# Altium schematic sheet Power_circuit.SchDoc
size A4; SheetNumber: 2; SheetTotal: 5
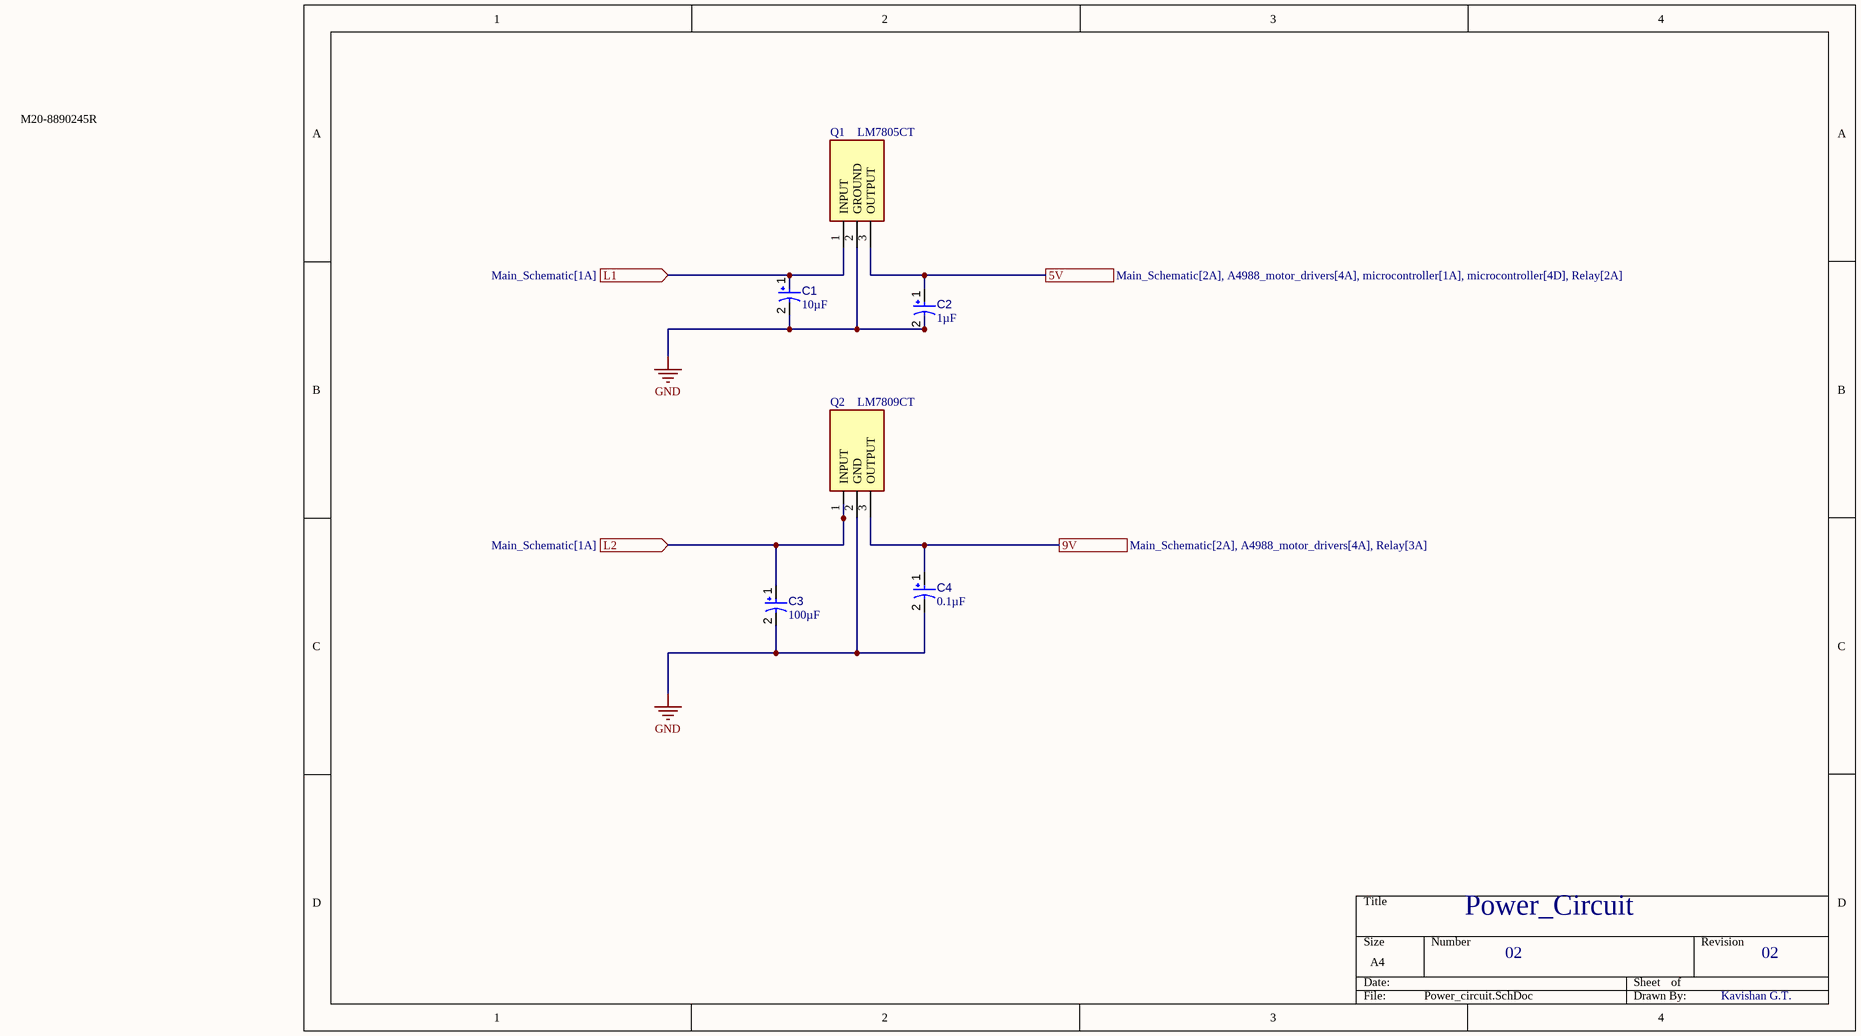
[diagram p0: Power_circuit.SchDoc]

## Parts
C1  value 10µF  [CAPPR55-200-1100X500X1200]  (hidden comment: ECA1HM100)
C2  value 1µF  [CAPPR55-200-1100X500X1200]  (hidden comment: ECA1HM100)
C3  value 100µF  [CAPPR55-200-1100X500X1200]  (hidden comment: ECA1HM100)
C4  value 0.1µF  [CAPPR55-200-1100X500X1200]  (hidden comment: ECA1HM100)
Q1  LM7805CT  [TO254P470X1028X1955-3P]
Q2  LM7809CT  [TO254P470X1016X2019-3P]

## Ports
5V (see Main_Schematic[2A], A4988_motor_drivers[4A], microcontroller[1A], microcontroller[4D], Relay[2A]), 9V (see Main_Schematic[2A], A4988_motor_drivers[4A], Relay[3A]), L1 (in, see Main_Schematic[1A]), L2 (in, see Main_Schematic[1A])

## Nets
GND: C1.2 C2.2 C3.2 C4.2 Q1.2(GROUND) Q2.2(GND)
5V: C2.1 Q1.3(OUTPUT) ; port 5V
9V: C4.1 Q2.3(OUTPUT) ; port 9V
L1: C1.1 Q1.1(INPUT) ; port L1
L2: C3.1 Q2.1(INPUT) ; port L2

## Notes on the sheet
- M20-8890245R
- Power_Circuit
- 02
- Kavishan G.T.

## Library data of the parts
C1-C4 = CMP-001-00025-7: Aluminum Electrolytic Capacitor, 10 uF, +/- 20%, 50 V, -40 to 85 degC, 2-Pin THD, RoHS, Bulk; Manufacturer: Panasonic; Ripple Current (AC): 65mA; Voltage Rating: 50V; Mounting Technology: TH; RoHS Compliant: True; Capacitor Type: Electrolytic; Datasheet Version: Rev. 05, 10/2016; Min Operating Temperature: -40°C; Packaging: Bulk; Ripple Current: 65mA; Tolerance: 20%; Max Operating Temperature: 85°C; Datasheet URL: https://industrial.panasonic.com/cdbs/www-data/pdf/RDF0000/ABA0000C1218.pdf; Lead Pitch: 2mm; Pins: 2; Diameter: 5mm; Manufacturer URL: http://www.panasonic.com/; Package Reference: CAPPR55-200-1100X500X1200; Package Description: 2-Pin Radial Lead, Dia 5 mm, Height 12 mm; Case/Package: Radial; Package Quantity: 200
Q1 = LM7805CT: Integrated Circuit; Manufacturer_Name: Texas Instruments; Datasheet Link: http://www.ti.com/lit/ds/symlink/lm340.pdf; Height: 4.7mm; Manufacturer_Part_Number: LM7805CT; Mouser Part Number: 926-LM7805CT; Mouser Price/Stock: https://www.mouser.co.uk/ProductDetail/Texas-Instruments/LM7805CT?qs=QbsRYf82W3EaqXeMDVwIfQ%3D%3D; Arrow Part Number: LM7805CT; Arrow Price/Stock: https://www.arrow.com/en/products/lm7805ct/texas-instruments?region=europe
Q2 = LM7809CT: Power Supply; Manufacturer_Name: onsemi; Datasheet Link: https://mouser.componentsearchengine.com/Datasheets/2/LM7809CT.pdf; Height: 4.7mm; Manufacturer_Part_Number: LM7809CT; Mouser Part Number: 512-LM7809CT; Mouser Price/Stock: https://www.mouser.co.uk/ProductDetail/ON-Semiconductor-Fairchild/LM7809CT?qs=VOMQJJE%252BBNmmTueoZonUjQ%3D%3D; Arrow Part Number: LM7809CT; Arrow Price/Stock: https://www.arrow.com/en/products/lm7809ct/on-semiconductor?region=europe